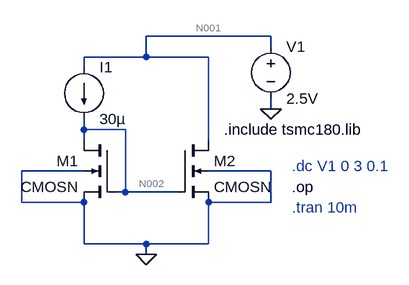
[diagram p0: schematic current_mirror (cs 30u).asc]
current_mirror (cs 30u).asc, the LTspice schematic file:
Version 4.1
SHEET 1 880 680
WIRE 272 32 80 32
WIRE 272 48 272 32
WIRE 80 64 80 32
WIRE 80 64 -16 64
WIRE 176 64 80 64
WIRE -16 80 -16 64
WIRE 272 144 272 128
WIRE -16 176 -16 160
WIRE 48 176 -16 176
WIRE -16 192 -16 176
WIRE 176 192 176 64
WIRE -16 240 -112 240
WIRE 272 240 176 240
WIRE 48 272 48 176
WIRE 48 272 32 272
WIRE 128 272 48 272
WIRE -112 288 -112 240
WIRE -16 288 -112 288
WIRE 272 288 272 240
WIRE 272 288 176 288
WIRE -16 352 -16 288
WIRE 80 352 -16 352
WIRE 176 352 176 288
WIRE 176 352 80 352
WIRE 80 368 80 352
FLAG 80 368 0
FLAG 272 144 0
SYMBOL voltage 272 32 R0
SYMATTR InstName V1
SYMATTR Value 2.5V
SYMBOL nmos4 128 192 R0
SYMATTR InstName M2
SYMATTR Value CMOSN
SYMATTR Value2 l=0.18um w=300nm
SYMBOL nmos4 32 192 M0
SYMATTR InstName M1
SYMATTR Value CMOSN
SYMATTR Value2 l=0.18um w=300nm
SYMBOL current -16 80 R0
SYMATTR InstName I1
SYMATTR Value 30µ
TEXT 200 176 Left 2 !.include tsmc180.lib
TEXT 304 232 Left 2 ;.dc V1 0 3 0.1
TEXT 304 264 Left 2 !.op
TEXT 304 296 Left 2 ;.tran 10m

The netlist it stands for:
* current_mirror (cs 30u).asc
V1 N001 0 2.5V
M2 N001 N002 0 0 CMOSN l=0.18um w=300nm
M1 N002 N002 0 0 CMOSN l=0.18um w=300nm
I1 N001 N002 30µ
.model NMOS NMOS
.model PMOS PMOS
.lib standard.mos
.include tsmc180.lib
* .dc V1 0 3 0.1
.op
* .tran 10m
.backanno
.end

* Results of the author's LTspice run, read from the files saved beside the schematic
* Operating Point:
*   V(n002) = 782.6 mV
*   V(n001) = 2.5 V
*   I(V1) = -71.77 µA
*   Id(M1) = 30 µA
*   Ig(M1) = 0 A
*   Is(M1) = -30 µA
*   Ib(M1) = -792.6 fA
*   I(I1) = 30 µA
*   Id(M2) = 41.77 µA
*   Ig(M2) = 0 A
*   Is(M2) = -41.77 µA
*   Ib(M2) = -2.51 pA